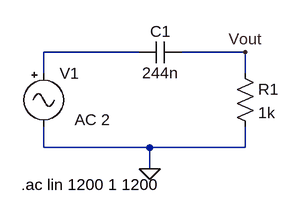
[diagram p0: schematic 3_12_pablo_gomez_tp6_ej2.asc]
3_12_pablo_gomez_tp6_ej2.asc, the LTspice schematic file:
Version 4
SHEET 1 880 680
WIRE 176 112 32 112
WIRE 336 112 240 112
WIRE 32 144 32 112
WIRE 336 144 336 112
WIRE 32 256 32 224
WIRE 192 256 32 256
WIRE 336 256 336 224
WIRE 336 256 192 256
WIRE 192 288 192 256
FLAG 192 288 0
FLAG 336 112 Vout
SYMBOL Misc\\signal 32 128 R0
WINDOW 123 47 86 Left 2
WINDOW 39 0 0 Left 0
SYMATTR InstName V1
SYMATTR Value ""
SYMATTR Value2 AC 2
SYMBOL cap 240 96 R90
WINDOW 0 0 32 VBottom 2
WINDOW 3 32 32 VTop 2
SYMATTR InstName C1
SYMATTR Value 244n
SYMBOL res 320 128 R0
SYMATTR InstName R1
SYMATTR Value 1k
TEXT -2 312 Left 2 !.ac lin 1200 1 1200

The netlist it stands for:
* 3_12_pablo_gomez_tp6_ej2.asc
V1 N001 0 AC 2
C1 Vout N001 244n
R1 Vout 0 1k
.ac lin 1200 1 1200
.backanno
.end